# EAGLE board MPB-03a (EAGLE 6.0)
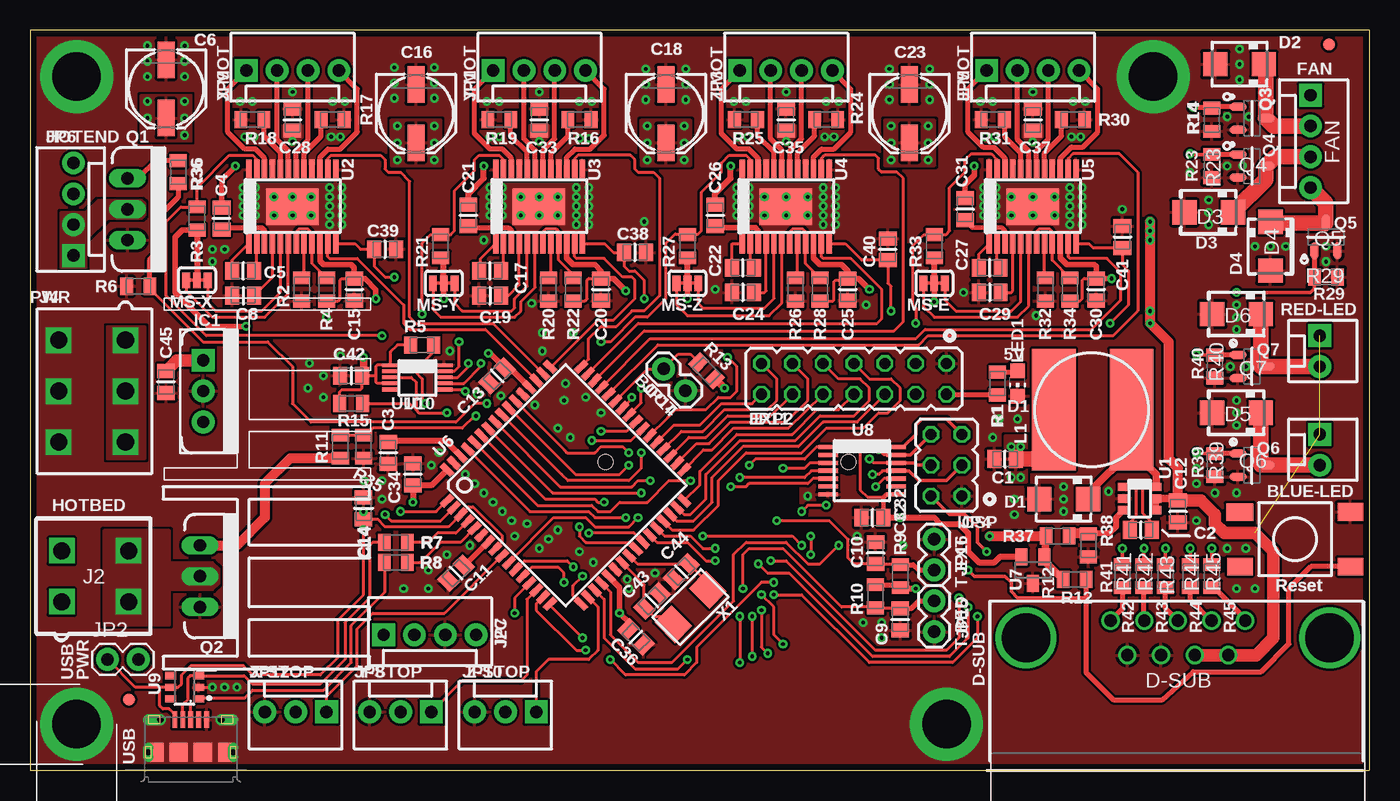
[diagram p1: board, top side]
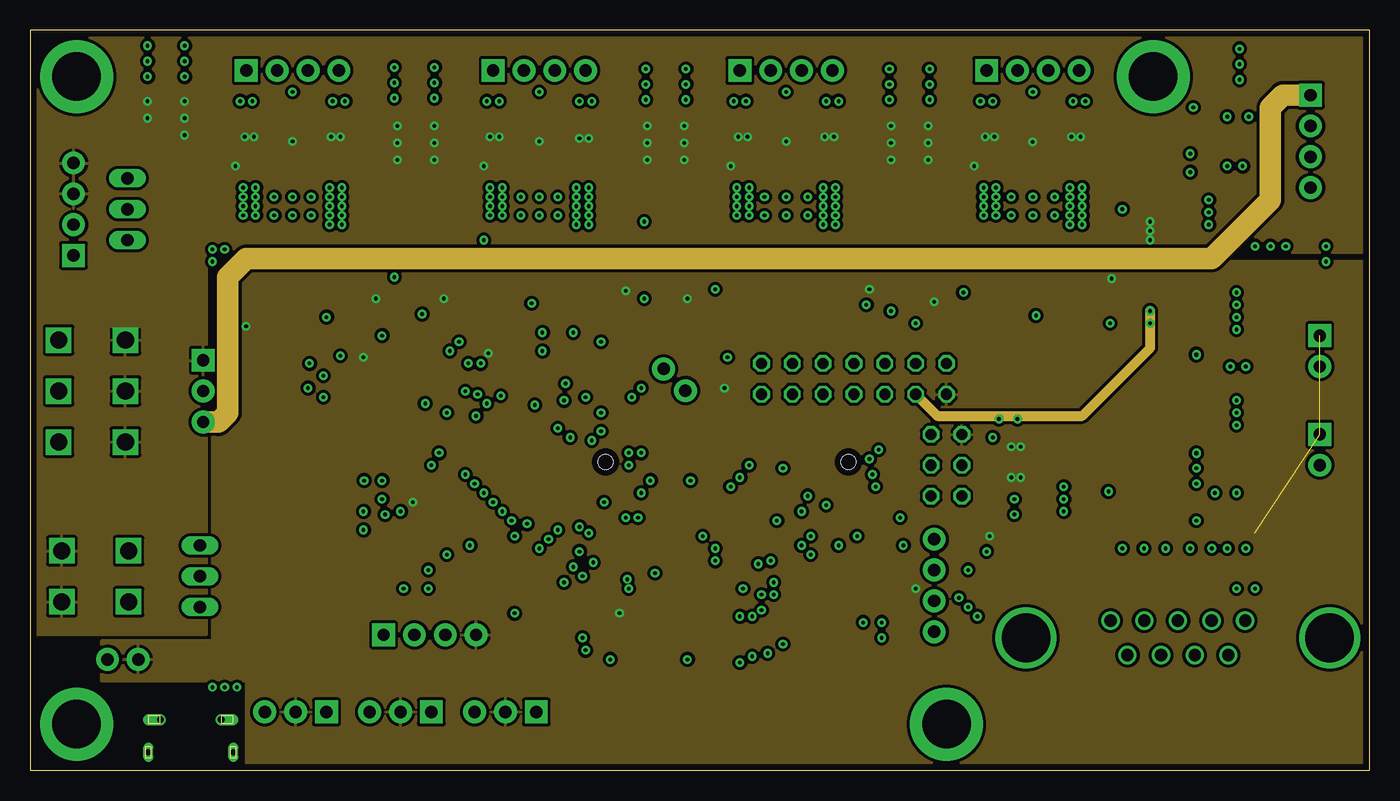
[diagram p2: board, inner layer PWR]
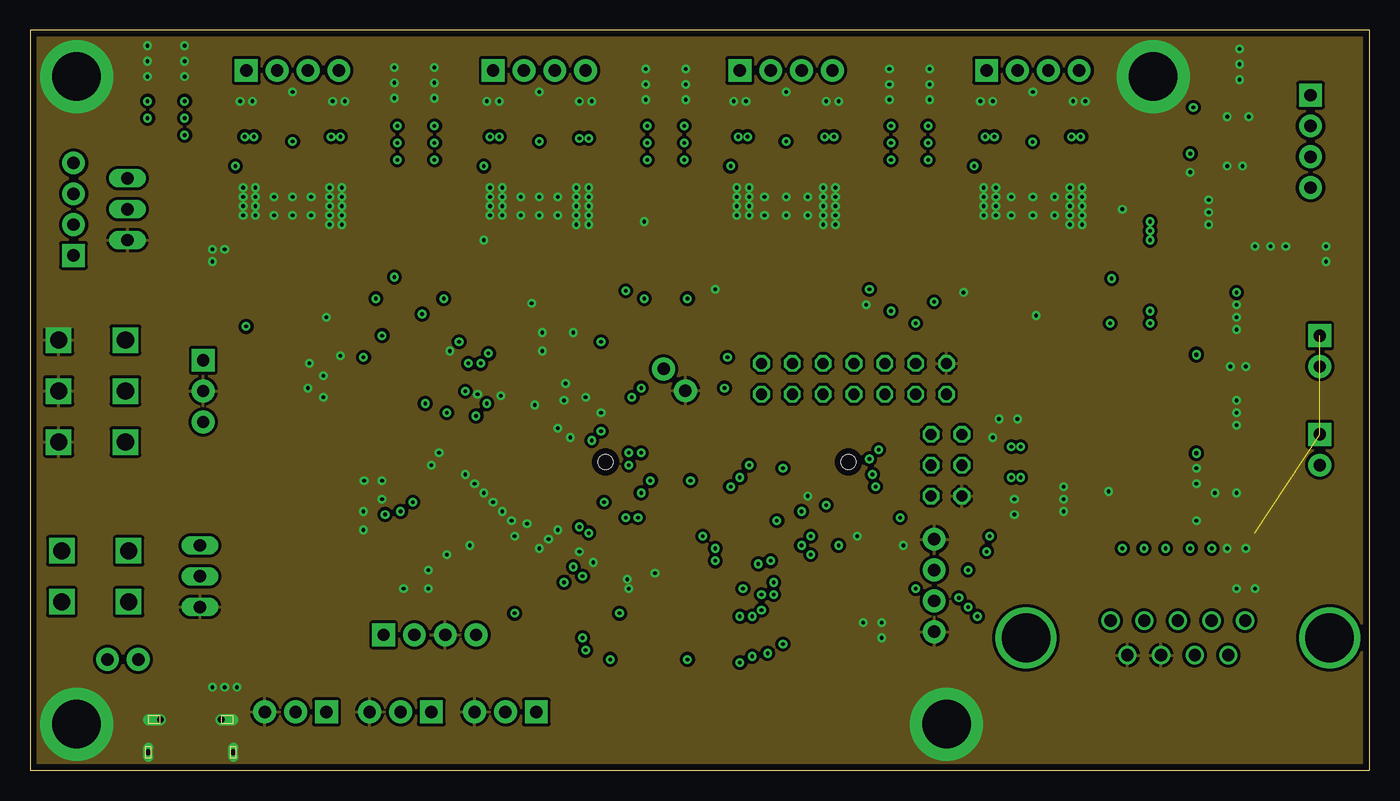
[diagram p3: board, inner layer GND]
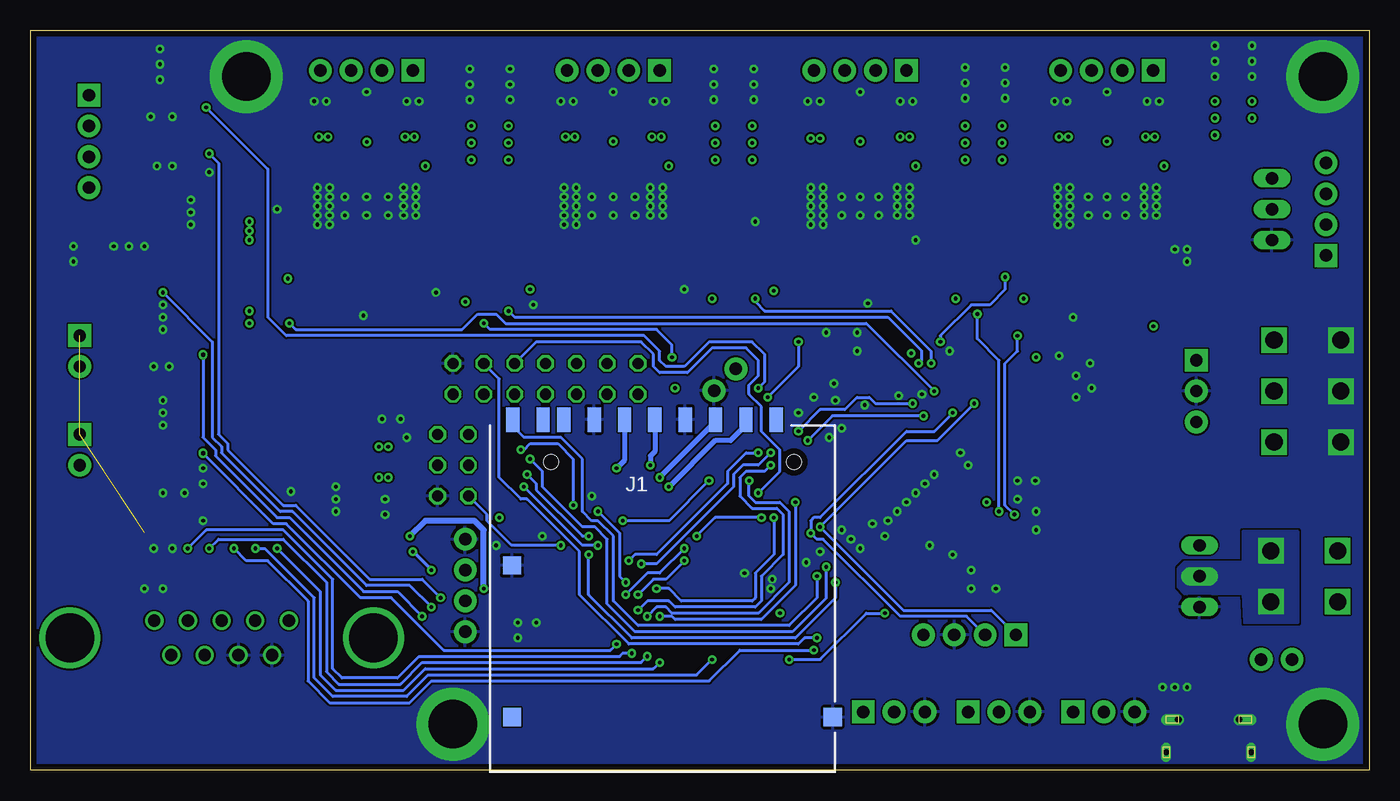
[diagram p4: board, bottom side, seen from below]

Size 110.24 x 60.96 mm. Coordinates in mm from the lower left corner, seen from the top.
Outline: 0,60.96 0,0 110.24,0 110.24,60.96 0,60.96
Copper layers (1*2+3*16): Top 0.035mm / dielectric 0.6mm / PWR 0.035mm / dielectric 0.2mm / GND 0.035mm / dielectric 0.6mm / Bottom 0.035mm
Design rules: minimum track width 6mil, minimum drill 12mil, track to track 6mil, track to pad 7mil, pad to pad 6mil, via to via 6mil, smd to smd 0mil, copper to edge 20mil, drill to drill 10mil, minimum pad ring 6mil, minimum via ring 8mil, stop-mask expansion 6mil, vias tented up to drill 100mil, thermal gap 10mil

## Footprints (pad centres in the part's own frame; a part is rotated, then mirrored left to right if it is on the bottom)
MOLEX-1X2 = drill 1.016 pad 1.88 square: 1 0,0 | drill 1.016 pad 1.88: 2 2.54,0
CAPC2012X145AN = smd 1.15 x 1.45: 1 -0.9,0; 2 0.9,0
PANASONIC_D = smd 3 x 1.4: + 2.4,0; - -2.4,0
SMA = smd 2 x 2: A 2,0; C -2,0
618009211721 = drill 1: 1 -5.54,1.42; 2 -2.77,1.42; 3 0,1.42; 4 2.77,1.42; 5 5.54,1.42; 6 -4.155,-1.42; 7 -1.385,-1.42; 8 1.385,-1.42; 9 4.155,-1.42 | drill 4: Z1 -12.5,0; Z2 12.5,0
MOLEX-1X4 = drill 1.016 pad 1.88 square: 1 0,0 | drill 1.016 pad 1.88: 2 2.54,0; 3 5.08,0; 4 7.62,0
TO220-15X17X25 = drill 1 pad 1.88: GND 0,0; OUT 2.54,0 | drill 1 pad 1.88 square: IN -2.54,0
SD-ATTEND = smd 1.1 x 2: 1 6.85,3.5; 2 4.35,3.5; 3 1.85,3.5; 4 -0.65,3.5; 5 -3.15,3.5; 6 -5.65,3.5; 7 -8.15,3.5; 8 -9.85,3.5; 9 9.35,3.5; SB -12.35,3.5 | smd 1.5 x 1.5: G 14,-21; SA -12.4,-21; SC -12.4,-8.5 | hole 1.2: -9.2,0; 10.8,0
5566-4 = drill 1.4 square: 1 2.1,-2.75; 2 -2.1,-2.75; 3 2.1,2.75; 4 -2.1,2.75
USB-MICROB-PTH = smd 0.4 x 1.35: D+ 0,1.905; D- -0.65,1.905; GND 1.3,1.905; ID 0.65,1.905; VBUS -1.3,1.905 | drill 0.5 pad 0.78 long: GND1 -3.5,-0.795; GND6 3.5,-0.795 | smd 1.225 x 1.55: GND2 -2.86,-0.795 | smd 1.5 x 1.55: GND3 -1,-0.795; GND4 1,-0.795 | smd 1.2 x 1.55: GND5 2.86,-0.795 | drill 0.55 pad 0.95 offset: GND7 2.5,1.905; GND8 -2.5,1.905
5566-6 = drill 1.4 square: 1 4.2,-2.75; 2 0,-2.75; 3 -4.2,-2.75; 4 4.2,2.75; 5 0,2.75; 6 -4.2,2.75
1X02 = drill 1.016 pad 1.88: 1 0,0; 2 2.54,0
JP3Q = drill 0.914 octagon: 1 -2.54,-1.27; 2 -2.54,1.27; 3 0,-1.27; 4 0,1.27; 5 2.54,-1.27; 6 2.54,1.27
MOLEX-1X3 = drill 1.016 pad 1.88 square: 1 0,0 | drill 1.016 pad 1.88: 2 2.54,0; 3 5.08,0
JP7Q = drill 0.914 octagon: 1 -7.62,-1.27; 2 -7.62,1.27; 3 -5.08,-1.27; 4 -5.08,1.27; 5 -2.54,-1.27; 6 -2.54,1.27; 7 0,-1.27; 8 0,1.27; 9 2.54,-1.27; 10 2.54,1.27; 11 5.08,-1.27; 12 5.08,1.27; 13 7.62,-1.27; 14 7.62,1.27
FIDUCIAL-1X2.5 = smd 1 x 1: 1 0,0
SDR1006 = smd 10.008 x 3.607: P$1 0,3.048; P$2 0,-3.353
CHIP-LED0805 = smd 1.2 x 1.2: A 0,-1.05; C 0,1.05
SJ_3_CONNECTED = smd 0.635 x 1.27: 1 -0.889,0; 2 0,0; 3 0.889,0
TO220V = drill 1.016 long: 1 -2.54,0; 2 0,0; 3 2.54,0
SOT95P280X135-3N = smd 1.4 x 0.65: 1 -1.15,0.95; 2 -1.15,-0.95; 3 1.15,0
RESC2012X70N = smd 1.05 x 1.4: 1 -0.95,0; 2 0.95,0
TACTILE_SWITCH_TALL = smd 2.1 x 1.45: A1 -4.55,-2.25; A2 4.55,-2.25; B2 4.55,2.25 | smd 2.25 x 1.45: B1 -4.55,2.225
TSOT6 = smd 0.69 x 1: 1 -1,-1.4; 2 -0.05,-1.4; 3 0.9,-1.4; 4 0.9,1.2; 5 -0.05,1.2; 6 -1,1.2
TSSOP-24 = smd 0.45 x 1.65: 1 -3.6,-3.1; 2 -2.95,-3.1; 3 -2.3,-3.1; 4 -1.65,-3.1; 5 -1,-3.1; 6 -0.35,-3.1; 7 0.3,-3.1; 8 0.95,-3.1; 9 1.6,-3.1; 10 2.25,-3.1; 11 2.9,-3.1; 12 3.55,-3.1; 13 3.55,3; 14 2.9,3; 15 2.25,3; 16 1.6,3; 17 0.95,3; 18 0.3,3; 19 -0.35,3; 20 -1,3; 21 -1.65,3; 22 -2.3,3; 23 -2.95,3; 24 -3.6,3 | smd 4.32 x 3: PAD -0.025,-0.05
TQFP64-2 = smd 1.194 x 0.508: 1 -7.8,6; 2 -7.8,5.2; 3 -7.8,4.4; 4 -7.8,3.6; 5 -7.8,2.8; 6 -7.8,2; 7 -7.8,1.2; 8 -7.8,0.4; 9 -7.8,-0.4; 10 -7.8,-1.2; 11 -7.8,-2; 12 -7.8,-2.8; 13 -7.8,-3.6; 14 -7.8,-4.4; 15 -7.8,-5.2; 16 -7.8,-6; 33 7.8,-6; 34 7.8,-5.2; 35 7.8,-4.4; 36 7.8,-3.6; 37 7.8,-2.8; 38 7.8,-2; 39 7.8,-1.2; 40 7.8,-0.4; 41 7.8,0.4; 42 7.8,1.2; 43 7.8,2; 44 7.8,2.8; 45 7.8,3.6; 46 7.8,4.4; 47 7.8,5.2; 48 7.8,6 | smd 0.508 x 1.194: 17 -6,-7.8; 18 -5.2,-7.8; 19 -4.4,-7.8; 20 -3.6,-7.8; 21 -2.8,-7.8; 22 -2,-7.8; 23 -1.2,-7.8; 24 -0.4,-7.8; 25 0.4,-7.8; 26 1.2,-7.8; 27 2,-7.8; 28 2.8,-7.8; 29 3.6,-7.8; 30 4.4,-7.8; 31 5.2,-7.8; 32 6,-7.8; 49 6,7.8; 50 5.2,7.8; 51 4.4,7.8; 52 3.6,7.8; 53 2.8,7.8; 54 2,7.8; 55 1.2,7.8; 56 0.4,7.8; 57 -0.4,7.8; 58 -1.2,7.8; 59 -2,7.8; 60 -2.8,7.8; 61 -3.6,7.8; 62 -4.4,7.8; 63 -5.2,7.8; 64 -6,7.8
SOT23C = smd 1 x 1.4: 1 -0.95,-1.1; 2 0.95,-1.1; 3 0,1.1
TSSOP14 = smd 0.35 x 1.6: 1 -2,-2.9; 2 -1.35,-2.9; 3 -0.7,-2.9; 4 -0.05,-2.9; 5 0.6,-2.9; 6 1.25,-2.9; 7 1.9,-2.9; 8 1.9,2.7; 9 1.25,2.7; 10 0.6,2.7; 11 -0.05,2.7; 12 -0.7,2.7; 13 -1.35,2.7; 14 -2,2.7
SOT23-6 = smd 0.6 x 0.9: 1 -0.95,-1.15; 2 0,-1.15; 3 0.95,-1.15; 4 0.95,1.15; 5 0,1.15; 6 -0.95,1.15
MSOP10 = smd 0.3 x 1.4: 1 -1,-2.2; 2 -0.5,-2.2; 3 0,-2.2; 4 0.5,-2.2; 5 1,-2.2; 6 1,2.2; 7 0.5,2.2; 8 0,2.2; 9 -0.5,2.2; 10 -1,2.2
NDK-XTAL = smd 2 x 2.4: P$1 -2,0; P$2 2,0

## Placement (x,y rotation side)
BLUE-LED  [MOLEX-1X2]  106.17,27.69 270 top
C1  22uF  [CAPC2012X145AN]  80.26,25.65 180 top
C2  0.22uF  [CAPC2012X145AN]  91.44,19.81 180 top
C3  0.1uF  [CAPC2012X145AN]  29.46,26.16 270 top
C4  0.1uF  [CAPC2012X145AN]  15.75,45.47 270 top
C5  0.1uF  [CAPC2012X145AN]  17.53,41.15 180 top
C6  100uF  [PANASONIC_D]  11.18,56.13 270 top
C8  0.22uF  [CAPC2012X145AN]  17.53,39.12 0 top
C9  10uF  [CAPC2012X145AN]  71.63,12.45 90 top
C10  10uF  [CAPC2012X145AN]  69.6,17.91 270 top
C11  1uF  [CAPC2012X145AN]  35.05,16.26 45 top
C12  1uF  [CAPC2012X145AN]  94.49,21.34 270 top
C13  0.1uF  [CAPC2012X145AN]  38.43,32.51 45 top
C14  0.1uF  [CAPC2012X145AN]  27.43,21.59 90 top
C15  10uF  [CAPC2012X145AN]  26.67,39.62 90 top
C16  100uF  [PANASONIC_D]  31.75,54.1 270 top
C17  0.1uF  [CAPC2012X145AN]  37.85,41.15 180 top
C18  100uF  [PANASONIC_D]  52.32,54.1 270 top
C19  0.22uF  [CAPC2012X145AN]  37.85,39.12 0 top
C20  10uF  [CAPC2012X145AN]  46.99,39.62 90 top
C21  0.1uF  [CAPC2012X145AN]  36.07,45.72 270 top
C22  0.1uF  [CAPC2012X145AN]  58.67,41.4 180 top
C23  100uF  [PANASONIC_D]  72.39,54.1 270 top
C24  0.22uF  [CAPC2012X145AN]  58.67,39.37 0 top
C25  10uF  [CAPC2012X145AN]  67.31,39.62 90 top
C26  0.1uF  [CAPC2012X145AN]  56.39,45.72 270 top
C27  0.1uF  [CAPC2012X145AN]  78.99,41.4 180 top
C28  0.1uF  [CAPC2012X145AN]  21.59,53.59 90 top
C29  0.22uF  [CAPC2012X145AN]  78.99,39.37 0 top
C30  10uF  [CAPC2012X145AN]  87.76,39.62 90 top
C31  0.1uF  [CAPC2012X145AN]  76.96,46.23 270 top
C32  10uF  [CAPC2012X145AN]  69.34,20.83 180 top
C33  0.1uF  [CAPC2012X145AN]  41.91,53.59 90 top
C34  0.1uF  [CAPC2012X145AN]  31.5,24.38 270 top
C35  0.1uF  [CAPC2012X145AN]  62.23,53.59 90 top
C36  0.1uF  [CAPC2012X145AN]  49.86,11 135 top
C37  0.1uF  [CAPC2012X145AN]  82.55,53.59 90 top
C38  0.1uF  [CAPC2012X145AN]  49.78,42.67 0 top
C39  0.1uF  [CAPC2012X145AN]  29.21,42.93 0 top
C40  0.1uF  [CAPC2012X145AN]  70.61,42.93 90 top
C41  0.1uF  [CAPC2012X145AN]  89.92,43.94 90 top
C42  0.1uF  [CAPC2012X145AN]  26.42,32.51 0 top
C43  10pF  [CAPC2012X145AN]  51.18,13.97 225 top
C44  10pF  [CAPC2012X145AN]  53.59,16.38 45 top
C45  0.1uF  [CAPC2012X145AN]  11.18,32 270 top
D1  [SMA]  85.09,22.35 180 top
D2  [SMA]  99.57,58.17 180 top
D3  [SMA]  97.03,45.97 180 top
D4  [SMA]  102.11,43.18 270 top
D5  [SMA]  99.31,29.46 180 top
D6  [SMA]  99.31,37.59 180 top
D-SUB  618009211721  [618009211721]  94.49,10.92 0 top
FAN  MOT-Y  [MOLEX-1X4]  105.41,55.63 270 top
IC1  [TO220-15X17X25]  14.22,31.24 270 top
J1  SD-ATTEND  [SD-ATTEND]  58.17,25.4 0 bottom
J2  5566-4  [5566-4]  5.33,16 270 top
J3  USB-MICRO-PTH  [USB-MICROB-PTH]  13.21,2.29 0 top
J4  PCIE  [5566-6]  5.08,31.24 90 top
JP1  MOT-Y  [MOLEX-1X4]  38.1,57.66 0 top
JP2  USBPWR  [1X02]  6.35,9.14 0 top
JP3  MOT-Z  [MOLEX-1X4]  58.42,57.66 0 top
JP4  ICSP  [JP3Q]  75.44,25.15 90 top
JP5  MOT-E  [MOLEX-1X4]  78.74,57.66 0 top
JP6  HOTEND  [MOLEX-1X4]  3.56,42.42 90 top
JP7  I2C  [MOLEX-1X4]  29.08,11.18 0 top
JP8  Y-STOP  [MOLEX-1X3]  33.02,4.83 180 top
JP9  MOT-X  [MOLEX-1X4]  17.78,57.66 0 top
JP10  Z-STOP  [MOLEX-1X3]  41.66,4.83 180 top
JP11  EXP2  [JP7Q]  67.82,32.26 180 top
JP12  X-STOP  [MOLEX-1X3]  24.38,4.83 180 top
JP14  BOOT  [1X02]  53.94,31.28 135 top
JP15  B-THERM  [1X02]  74.42,13.97 270 top
JP16  E-THERM  [1X02]  74.42,16.51 90 top
JP26  FIDUCIAL1X2.5  [FIDUCIAL-1X2.5]  8.13,5.84 0 top
JP33  FIDUCIAL1X2.5  [FIDUCIAL-1X2.5]  106.93,59.82 0 top
L1  47uH  [SDR1006]  87.63,29.72 270 top
LED1  PWR  [CHIP-LED0805]  81.28,31.88 180 top
MS-E  [SJ_3_CONNECTED]  74.42,40.13 180 top
MS-X  [SJ_3_CONNECTED]  13.72,40.39 180 top
MS-Y  [SJ_3_CONNECTED]  34.04,40.13 180 top
MS-Z  [SJ_3_CONNECTED]  54.1,40.13 180 top
Q1  RFP30N06LE  [TO220V]  8,46.23 270 top
Q2  RFP30N06LE  [TO220V]  13.97,16 270 top
Q3  RFP30N06LE  [SOT95P280X135-3N]  100.58,53.72 0 top
Q4  RFP30N06LE  [SOT95P280X135-3N]  100.58,49.78 0 top
Q5  RFP30N06LE  [SOT95P280X135-3N]  106.68,43.94 90 top
Q6  RFP30N06LE  [SOT95P280X135-3N]  100.58,25.15 0 top
Q7  RFP30N06LE  [SOT95P280X135-3N]  100.58,33.27 0 top
R1  330  [RESC2012X70N]  79.63,31.88 270 top
R2  10k  [RESC2012X70N]  22.35,39.62 270 top
R3  100k  [RESC2012X70N]  13.72,45.47 90 top
R4  100k  [RESC2012X70N]  24.38,39.62 90 top
R5  4.7k  [RESC2012X70N]  32.26,35.05 180 top
R6  100k  [RESC2012X70N]  8.89,39.88 180 top
R7  22  [RESC2012X70N]  30.1,18.8 0 top
R8  22  [RESC2012X70N]  30.1,17.14 0 top
R9  4.7k  [RESC2012X70N]  71.63,16 270 top
R10  4.7k  [RESC2012X70N]  69.6,14.35 90 top
R11  100  [RESC2012X70N]  25.53,26.67 270 top
R12  100k  [RESC2012X70N]  85.98,15.75 180 top
R13  100k  [RESC2012X70N]  55.67,32.91 315 top
R14  100k  [RESC2012X70N]  97.28,53.59 270 top
R15  4.7k  [RESC2012X70N]  26.42,30.23 180 top
R16  0.11  [RESC2012X70N]  45.21,53.59 0 top
R17  0.11  [RESC2012X70N]  24.89,53.59 0 top
R18  0.11  [RESC2012X70N]  18.29,53.59 180 top
R19  0.11  [RESC2012X70N]  38.61,53.59 180 top
R20  10k  [RESC2012X70N]  42.67,39.62 270 top
R21  100k  [RESC2012X70N]  33.78,43.18 90 top
R22  100k  [RESC2012X70N]  44.7,39.62 90 top
R23  100k  [RESC2012X70N]  97.28,49.78 270 top
R24  0.11  [RESC2012X70N]  65.53,53.59 0 top
R25  0.11  [RESC2012X70N]  58.93,53.59 180 top
R26  10k  [RESC2012X70N]  62.99,39.62 270 top
R27  100k  [RESC2012X70N]  54.1,43.18 90 top
R28  100k  [RESC2012X70N]  65.02,39.62 90 top
R29  100k  [RESC2012X70N]  106.68,40.64 0 top
R30  0.11  [RESC2012X70N]  85.85,53.59 0 top
R31  0.11  [RESC2012X70N]  79.25,53.59 180 top
R32  10k  [RESC2012X70N]  83.57,39.62 270 top
R33  100k  [RESC2012X70N]  74.42,43.18 90 top
R34  100k  [RESC2012X70N]  85.6,39.62 90 top
R35  100k  [RESC2012X70N]  27.43,26.67 270 top
R36  100  [RESC2012X70N]  12.19,49.28 90 top
R37  5.6k  [RESC2012X70N]  84.58,19.3 0 top
R38  1k  [RESC2012X70N]  87.12,18.54 270 top
R39  100k  [RESC2012X70N]  97.54,25.15 270 top
R40  100k  [RESC2012X70N]  97.54,33.27 270 top
R41  100  [RESC2012X70N]  89.92,16 270 top
R42  100  [RESC2012X70N]  91.69,16 270 top
R43  100  [RESC2012X70N]  93.47,16 270 top
R44  100  [RESC2012X70N]  95.5,16 270 top
R45  100  [RESC2012X70N]  97.28,16 270 top
RED-LED  [MOLEX-1X2]  106.17,35.81 270 top
S1  Reset  [TACTILE_SWITCH_TALL]  104.14,19.05 0 top
U1  LM2841  [TSOT6]  91.44,22.35 270 top
U2  A4982  [TSSOP-24]  21.59,46.48 0 top
U3  A4982  [TSSOP-24]  41.91,46.48 0 top
U4  A4982  [TSSOP-24]  62.23,46.48 0 top
U5  A4982  [TSSOP-24]  82.55,46.48 0 top
U6  AT90USB1286  [TQFP64-2]  44.07,23.5 45 top
U7  AP7313  [SOT23C]  82.55,16.51 180 top
U8  TXB0104  [TSSOP14]  68.58,24.64 270 top
U9  PRTR5V0U4D  [SOT23-6]  12.7,6.86 90 top
U10  MCP4728  [MSOP10]  31.88,32.38 270 top
X1  16MHz  [NDK-XTAL]  54.36,13.46 225 top

## Tracks (layer width: path | path; a pad name or v marks a point on that pad's centre or on a via)
!E-ENABLE  (via drill 0.3)
  Top 0.254: v57.4,34.04 58.17,33.27 58.17,31.24 57.66,30.73 56.64,30.73 55.63,29.72 53.12,29.72 52.48,29.08 | U5.23 79.6,50.32 79.12,50.8 77.47,50.8 76.96,50.29 76.96,49.28 75.69,48.01 75.69,44.45 75.37,44.13 R33.2 73.59,44.13 72.64,43.18 72.64,38.35 72.9,38.1 v72.9,36.83 | U6.38 52.48,29.08 | 52.48,29.08
  Bottom 0.254: v57.4,34.04 57.4,35.05 58.67,36.32 72.39,36.32 v72.9,36.83
!HOTBED  (via drill 0.3)
  Top 0.254: v46.23,27.18 49.45,27.18 U6.39 | R11.1 R35.1 27.69,27.69 28.19,28.19 35.56,28.19 36.57,29.2 v36.69,29.2
  Bottom 0.254: v36.69,29.2 44.2,29.2 v46.23,27.18
!HOTEND  (via drill 0.3)
  Top 0.254: v37.59,30.23 36.58,30.23 35.05,28.7 23.11,28.7 21.59,30.23 21.59,33.27 19.56,35.31 14.22,35.31 9.84,39.69 R6.1 | U6.40 49.08,27.94 v46.99,27.94
  Top 0.406: R6.1 9.84,42.1 10.41,42.67 10.41,45.47 12.19,47.24 R36.1
  Bottom 0.254: v37.59,30.23 40.64,30.23 41.15,30.73 42.16,30.73 43.18,29.72 45.21,29.72 v46.99,27.94
!RESET  (via drill 0.3)
  Top 0.254: U6.20 47.75,14.72 47.75,11.18 50.04,8.89 52.83,8.89 57.91,13.97 57.91,17.78 58.93,18.8 62.23,18.8 64.01,17.02 65.02,17.02 v66.55,18.54
  Top 0.305: JP4.2 75.69,21.08 76.96,21.08 77.98,20.07 77.98,18.8 v78.74,18.03 | v77.22,16.51 77.72,16 80.26,16 80.77,15.49 80.77,14.73 81.28,14.22 86.87,14.22 86.87,15.69 R12.1
  Top 0.406: S1.A2 105.45,16.8 103.63,14.99 103.63,10.41 101.35,8.13 95.76,8.13 93.22,5.84 89.15,5.84 86.93,8.07 R12.1
  Bottom 0.254: v66.55,18.54 70.61,18.54 72.64,20.57 72.64,21.08 JP4.2
  Bottom 0.305: v77.22,16.51 v78.74,18.03
!X-ENABLE  (via drill 0.3)
  Top 0.254: U2.23 18.64,50.32 18.29,50.67 16.38,50.67 13.72,48.01 R3.2 12.38,46.42 11.18,45.21 11.18,39.12 14.48,35.81 v28.96,35.81 | v29.21,21.08 29.72,20.57 33.79,20.57 U6.2
  Bottom 0.254: v29.21,21.08 29.97,21.84 29.97,33.53 28.96,34.54 v28.96,35.81
!Y-ENABLE  (via drill 0.3)
  Top 0.254: U3.23 38.96,50.32 38.61,50.67 36.96,50.67 36.58,50.29 36.58,49.4 34.92,47.75 34.92,44.45 34.6,44.13 R21.2 32.95,44.13 32.26,43.43 v32.26,37.59 | v30.48,21.34 33.42,21.34 U6.1
  Bottom 0.254: v30.48,21.34 30.48,33.78 32.26,35.56 v32.26,37.59
!Z-ENABLE  (via drill 0.3)
  Top 0.254: U4.23 59.28,50.32 58.93,50.67 57.53,50.67 56.9,50.04 56.9,49.28 55.24,47.62 55.24,44.45 54.99,44.2 54.04,44.2 | 54.04,44.2 53.09,44.2 52.32,43.43 52.32,38.86 50.8,37.34 49.78,37.34 47.75,35.31 v46.99,35.31 | 54.04,44.2 R27.2 | U6.42 49.53,30.65 v49.53,30.73
  Bottom 0.254: v46.99,35.31 46.99,33.27 v49.53,30.73
+3V3  (via drill 0.3)
  Top 0.254: U8.8 | 70.24,22.49 68.95,22.49 68.33,23.11 68.33,26.16 67.85,26.64 U8.1 64.74,26.64 63.75,25.65 59.69,25.65 v59.18,25.15
  Top 0.356: U8.8 70.49,22.74 70.24,22.49 C32.1
  Top 0.508: C32.1 v71.63,20.83 74.42,20.83 74.93,20.32 76.45,20.32 77.22,19.56 77.22,18.03 78.15,17.1 79.33,17.1 79.76,17.53 79.84,17.61 U7.2
  Bottom 0.406: J1.4 58.82,26.27 59.18,25.91 v59.18,25.15
+5V  (via drill 0.3)
  Top 0.254: R4.1 25.34,38.67 25.53,38.86 25.53,40.39 25.65,40.51 26.66,40.51 C15.2 | R22.1 45.66,38.67 45.85,38.86 45.85,40.39 45.98,40.52 C20.2 | C25.2 67.17,40.39 66.29,40.39 66.17,40.26 66.17,38.73 66.11,38.67 R28.1 | R34.1 86.43,38.67 86.61,38.86 86.61,40.39 86.75,40.52 C30.2 | 49.33,12.14 49.33,11.99 49.28,11.94 | U10.4 28.57,31.89 28.45,32 28.45,32.51 | 28.45,32.51 28.45,33.27 28.56,33.38 U10.1 29.68,34.5 30.23,35.05 R5.2 | 28.45,32.51 C42.2 27.3,32.5 27.3,31.5 27.18,31.37 25.65,31.37 25.47,31.18 R15.2
  Top 0.305: U8.14 71.85,26.64 72.9,27.69 72.9,28.45 73.41,28.96 75.44,28.96 JP4.5
  Top 0.406: 49.28,11.94 49.22,11.94 C36.2 | R10.2 71.31,15.3 71.63,14.99 R9.2 | R1.2 75.44,30.93 JP11.2
  Top 0.457: U2.10 23.84,41.95 24.13,41.66 26.42,41.66 26.67,41.4 C15.2 27.55,40.52 28.45,39.62 v28.45,38.86 | R3.1 12.51,44.52 11.94,43.94 11.94,39.37 14.73,36.58 v17.76,36.58 | U3.10 44.16,42.2 44.7,41.66 46.48,41.66 46.99,41.15 C20.2 48.01,40.52 v49.02,39.51 | MS-Y.2 v34.04,38.86 | U4.10 64.48,42.2 65.02,41.66 66.8,41.66 67.31,41.15 C25.2 68.19,40.52 v69.09,39.62 | MS-Z.2 v54.1,38.86 | U5.10 84.8,42.2 85.34,41.66 87.63,41.66 87.76,41.53 C30.2 89.02,40.52 v89.03,40.51 | MS-E.2 v74.42,38.61 | U6.21 48.51,15.09 v48.51,12.95 49.33,12.14
  Top 0.508: R3.1 MS-X.2 | MS-Y.2 34.04,41.98 R21.1 | MS-Z.2 R27.1 | MS-E.2 R33.1 | R9.2 71.69,14.99 v72.9,14.99 | U6.64 33.03,23.48 C34.2 v31.5,22.1 | U6.52 39.51,33.15 C13.2 | v37.72,34.35 37.86,34.35 C13.2 | C13.2 38.99,33.15
  Top 0.61: v27.43,34.04 27.43,32.63 C42.2 | v57.15,31.5 56.41,32.24 R13.2 | 83.57,19.3 83.57,17.61 U7.1 83.5,17.28 R12.2
  Top 0.813: v78.99,19.3 83.57,19.3 R37.1
  Top 1.27: C1.1 83.82,25.65 84.33,26.16 84.33,29.67 L1.P$2
  Bottom 0.508: v72.9,14.99 72.9,19.81 73.66,20.57 77.72,20.57 v78.99,19.3
  other vias: 80.77,26.67 81.53,26.67 80.77,24.13 81.53,24.13
  pour PWR (isolate 0.254): 110.24,41.91 14.99,41.91 14.99,10.67 5.84,10.67 5.84,7.37 17.78,7.37 17.78,0 110.24,0
  pour Top (isolate 0.254): 82.04,23.75 82.04,27.56 80.26,27.56 80.26,23.75
+12V
  PWR 1.778: IC1.OUT 15.49,28.7 16.26,29.46 16.26,40.64 17.78,42.16 97.28,42.16 102.11,46.99 102.11,54.61 103.12,55.63 FAN.1
+24V  (via drill 0.3)  (2 unrouted)
  Top 0.254: 94.49,22.1 94.49,22.23 C12.1
  Top 0.406: v16.89,49.78 15.75,48.64 15.75,48.01
  Top 0.457: C4.1 15.75,48.01 | C31.1 76.96,48.26 77.72,49.02 v77.72,49.78
  Top 0.508: C31.1 76.57,47.13 | 36.44,46.62 C21.1 36.07,47.5 37.34,48.77 v37.34,49.78 | v57.66,49.78 57.66,48.77 56.39,47.5 C26.1
  Top 0.61: U1.4 U1.5 94.31,22.4 94.49,22.23
  Top 0.813: C12.1 94.49,24.89 93.73,25.65 93.73,35.31 v92.2,36.83 v92.2,37.85 v92.2,43.69 v92.2,44.45 v92.2,45.21
  Top 1.016: D-SUB.9 D-SUB.8 100.94,9.5 102.36,10.92 102.36,18.03 100.84,19.56 98.3,19.56 97.54,20.32 97.54,21.08 96.38,22.24 C12.1 | IC1.IN 12.05,33.78 C45.1
  PWR 0.813: JP11.4 74.68,29.21 86.61,29.21 92.2,34.8 v92.2,37.85
  other vias: 17.65,52.2 25.53,52.2 37.85,52.2 45.97,52.07 66.17,52.2 82.52,51.77 86.49,52.2 62.23,51.82 41.91,51.82 21.59,51.82 58.29,52.2 78.61,52.2 73.91,53.09 73.91,51.69 73.91,50.29 70.87,53.09 70.87,51.69 70.87,50.29 12.7,55.12 12.7,53.72 12.7,52.32 9.65,55.12 9.65,53.72 53.85,53.09 53.85,51.69 53.85,50.29 50.8,53.09 50.8,51.69 50.8,50.29 33.27,53.09 33.27,51.69 33.27,50.29 30.23,53.09 30.23,51.69 30.23,50.29 45.21,52.07 38.61,52.2 18.41,52.2 24.77,52.2 59.05,52.2 65.41,52.2 79.38,52.2 85.72,52.2
  pour PWR (isolate 0.254, rank 6): 110.24,42.67 14.48,42.42 14.48,11.18 0,11.18 0,60.96 110.24,60.96
  pour Top (no thermals): 78.74,50.04 86.61,50.04 86.61,51.31 87.88,52.58 87.88,53.09 77.47,53.09 77.47,52.32 78.74,51.05
  pour Top (isolate 0.254): 70.61,53.59 74.42,53.59 74.42,49.78 70.36,49.78 70.36,53.59
  pour Top (no thermals): 58.29,50.04 66.17,50.04 66.17,51.31 67.44,52.58 67.44,53.09 57.02,53.09 57.02,52.32 58.29,51.05
  pour Top (no thermals): 37.97,50.04 45.85,50.04 45.85,51.31 47.12,52.58 47.12,53.09 36.7,53.09 36.7,52.32 37.97,51.05
  pour Top (no thermals): 17.65,50.04 25.53,50.04 25.53,51.31 26.8,52.58 26.8,53.09 16.38,53.09 16.38,52.32 17.65,51.05
  pour Top: 9.14,55.63 13.21,55.63 13.21,51.82 9.14,51.82
  pour Top (isolate 0.254): 50.55,53.59 54.36,53.59 54.36,49.78 50.29,49.78 50.29,53.59
  pour Top (isolate 0.254): 29.97,53.59 33.78,53.59 33.78,49.78 29.72,49.78 29.72,53.59
  pour PWR (isolate 0.254, no thermals): 9.65,48.01 6.6,48.01 6.6,36.58 9.65,36.58
  pour Top (isolate 0.254, no thermals): 6.35,36.58 9.4,36.58 9.4,25.65 6.35,25.65
ALE
  Top 0.254: U6.43 50.82,33.08 JP14.2 52.14,33.09 53.34,34.29 54.36,34.29 55.12,33.53 55.05,33.53 R13.1
AREF
  Top 0.508: C3.1 29.58,27.18 34.16,27.18 U6.62
B-THERM  (via drill 0.3)
  Top 0.254: C9.2 71.57,13.4 R10.1 69.53,13.46 66.8,13.46 61.98,18.29 59.18,18.29 58.67,17.78 v58.67,14.99 | U6.61 41.14,21.34 45.97,21.34 46.48,20.83 v49.02,20.83
  Top 0.406: C9.2 72.53,13.35 73.15,13.97 JP15.1
  Bottom 0.254: v49.02,20.83 49.02,17.78 50.55,16.26 50.55,14.22 50.8,13.97 56.64,13.97 57.66,14.99 v58.67,14.99
BLUE-LED  (via drill 0.3)
  Top 0.254: U6.27 51.6,18.8 54.1,18.8 55.63,17.27 v56.39,17.27 | v61.98,10.41 61.21,11.18 61.21,13.46 v60.2,14.48
  Top 0.305: R39.1 v96.01,26.1 v96.01,26.16
  Top 0.406: Q6.1 R39.1
  Bottom 0.254: v61.98,10.41 62.48,9.91 76.2,9.91 80.52,14.22 83.06,14.22 89.15,20.32 90.24,20.32 v96.01,26.1 | v56.39,17.27 57.91,15.75 58.93,15.75 v60.2,14.48
CONTROLLER_FAN  (via drill 0.3)
  Top 0.254: v50.29,26.16 50.29,24.89 49.28,23.88 44.25,23.88 43.75,24.38 | 43.75,24.38 | U6.56 43.75,24.38 | v76.45,14.22 76.45,10.92 75.44,9.91 69.6,9.91 62.23,17.27 v60.96,17.27
  Top 0.305: R23.1 95.57,50.73 v95.5,50.8
  Top 0.406: Q4.1 R23.1
  Bottom 0.254: v50.29,26.16 51.31,26.16 52.83,24.64 52.83,23.62 58.67,17.78 60.45,17.78 v60.96,17.27 | v95.5,50.8 94.74,50.04 94.74,27.69 93.98,26.92 93.98,26.42 89.41,21.84 88.39,21.84 82.3,15.75 77.98,15.75 v76.45,14.22
E-DIR
  Top 0.254: U5.14 85.45,50.4 85.85,50.8 89.66,50.8 91.19,49.28 91.19,37.85 89.15,35.81 73.91,35.81 73.15,35.05 51.67,35.05 U6.44
E-STEP
  Top 0.254: U5.11 85.45,42.31 85.6,42.16 88.65,42.16 89.79,41.02 89.79,38.73 87.38,36.32 73.66,36.32 72.9,35.56 51.04,35.56 U6.45
E-THERM  (via drill 0.3)
  Top 0.254: 69.58,17.02 C10.2 | C10.2 71.57,17.01 R9.1 | C10.2 67.83,17.01 67.31,17.53 67.32,18.55 67.32,19.04 65.79,20.57 v61.47,20.57 | U6.60 41.76,21.84 46.23,21.84 46.74,21.34 47.75,21.34 48.51,22.1 50.8,22.1 52.58,23.88 v54.36,23.88
  Top 0.406: R9.1 72.71,16.95 73.15,16.51 JP16.1
  Bottom 0.254: v54.36,23.88 57.66,20.57 v61.47,20.57
EX-DIR  (via drill 0.3)
  Top 0.254: U6.19 47.24,14.1 47.24,10.92 49.78,8.38 53.34,8.38 v54.1,9.14
  Top 0.305: R42.1 v91.69,18.29
  Bottom 0.254: v54.1,9.14 55.37,7.87 77.47,7.87 79.25,6.1 85.34,6.1 86.87,7.62 86.87,14.22 90.93,18.29 v91.69,18.29
EX-ENABLE  (via drill 0.3)
  Top 0.254: U6.57 43.63,23.37 49.53,23.37 50.04,23.88 v51.05,23.88 | v59.44,12.7 v59.44,9.4
  Top 0.305: R44.1 v95.5,18.29
  Bottom 0.254: v51.05,23.88 51.05,22.61 50.55,22.1 48.51,22.1 47.75,21.34 47.75,15.49 50.29,12.95 57.4,12.95 57.91,13.46 58.67,13.46 v59.44,12.7 | v59.44,9.4 59.94,8.89 77.98,8.89 79.76,7.11 84.84,7.11 85.85,8.13 85.85,15.49 89.41,19.05 94.74,19.05 v95.5,18.29
EX-HOTEND  (via drill 0.3)
  Top 0.254: U6.55 44.88,24.38 48.51,24.38 v49.28,25.15 | v60.2,13.21 60.2,10.16 v60.71,9.65
  Top 0.305: R45.1 v97.28,18.29
  Bottom 0.254: v49.28,25.15 49.78,24.64 51.31,24.64 51.82,24.13 51.82,22.61 50.8,21.59 48.77,21.59 48.26,21.08 48.26,17.78 50.04,16 50.04,13.97 50.55,13.46 57.15,13.46 57.66,13.97 59.44,13.97 v60.2,13.21 | v60.71,9.65 61.47,9.65 61.72,9.4 78.23,9.4 80.01,7.62 84.58,7.62 85.34,8.38 85.34,15.75 89.41,19.81 95.76,19.81 v97.28,18.29
EX-STEP  (via drill 0.3)
  Top 0.254: U6.15 41.66,13.73 41.66,13.21 44.96,9.91 v45.72,9.91
  Top 0.305: R43.1 v93.47,18.29
  Bottom 0.254: v45.72,9.91 51.82,9.91 54.36,7.37 77.22,7.37 78.99,5.59 85.6,5.59 87.38,7.37 87.38,13.97 90.68,17.27 92.46,17.27 v93.47,18.29
EX-TERM  (via drill 0.3)
  Top 0.254: U6.59 42.38,22.35 46.48,22.35 46.74,22.1 v47.24,22.1 | v58.42,12.7 v58.42,8.89
  Top 0.305: R41.1 v89.92,18.29
  Bottom 0.254: v89.92,18.29 86.36,14.73 86.36,7.87 85.09,6.6 79.5,6.6 77.72,8.38 58.93,8.38 v58.42,8.89 | v47.24,22.1 47.24,15.24 50.04,12.45 57.15,12.45 57.4,12.7 v58.42,12.7
EXTRUDER_0_FAN  (via drill 0.3)
  Top 0.254: U6.54 43.98,26.42 43.98,26.38 44.2,26.16 46.48,26.16 46.99,26.67 48.77,26.67 v49.28,26.16 | v77.22,13.46 77.22,10.92 75.69,9.4 69.34,9.4 62.48,16.26 60.71,16.26 v59.94,17.02
  Top 0.305: R29.1 105.73,39.69 105.41,39.37 v99.31,39.37
  Top 0.406: Q5.1 R29.1
  Bottom 0.254: v49.28,26.16 50.29,25.15 51.56,25.15 52.32,24.38 52.32,23.37 58.67,17.02 v59.94,17.02 | v99.31,39.37 95.25,35.31 95.25,27.43 94.49,26.67 94.49,26.16 89.66,21.34 88.65,21.34 82.55,15.24 78.99,15.24 v77.22,13.46
GND  (via drill 0.3, 4 pad 6)
  Top 0.254: U9.2 v14.99,6.86
  other vias: 36.2,18.54 25.53,34.16 27.48,23.88 75.44,3.81 3.81,3.81 3.81,57.15 92.46,57.15 17.27,55.12 25.91,55.12 20.07,47.24 21.59,47.24 23.11,47.24 20.07,45.72 21.59,45.72 23.11,45.72 37.59,55.12 46.23,55.12 78.23,55.12 79.25,55.12 85.85,55.12 86.87,55.12 57.91,55.12 58.93,55.12 65.53,55.12 66.55,55.12 38.61,55.12 45.21,55.12 18.29,55.12 24.89,55.12 40.39,47.24 41.91,47.24 43.43,47.24 43.43,45.72 41.91,45.72 40.39,45.72 58.17,47.24 58.17,46.48 59.18,48.01 59.18,47.24 65.28,47.24 59.18,46.48 79.5,48.01 85.6,47.24 85.6,48.01 79.5,47.24 79.5,46.48 85.6,46.48 16,42.93 9.65,58.42 9.65,59.69 12.7,58.42 29.97,55.37 29.97,57.91 29.97,56.64 76.83,39.37 82.8,37.47 37.34,43.69 56.39,39.62 68.83,38.35 44.7,36.07 24.38,37.34 46.35,17.14 41.53,30.1 35.81,24.38 12.7,59.69 33.27,57.91 33.27,56.64 33.27,55.37 50.67,55.24 70.74,57.78 9.65,57.15 12.7,57.15 50.67,57.78 50.67,56.52 53.98,57.78 53.98,56.52 53.98,55.24 70.74,56.52 70.74,55.24 74.04,57.78 74.04,56.52 74.04,55.24 82.55,55.88 78.49,47.24 78.49,48.01 86.61,48.01 86.61,47.24 62.23,55.88 41.91,55.88 65.28,46.48 65.28,45.72 66.29,46.48 66.29,47.24 66.29,45.72 86.61,46.48 58.17,48.01 65.28,44.96 66.29,44.96 65.28,48.01 66.29,48.01 58.17,45.72 59.18,45.72 21.59,55.88 60.45,47.24 62.23,47.24 64.01,47.24 64.01,45.72 62.23,45.72 60.45,45.72 80.77,47.24 80.77,45.72 82.55,45.72 84.33,45.72 84.33,47.24 82.55,47.24 78.49,46.48 78.49,45.72 79.5,45.72 85.6,45.72 85.6,44.96 86.61,45.72 86.61,44.96 37.85,47.24 37.85,46.48 38.86,48.01 38.86,47.24 38.86,46.48 37.85,48.01 37.85,45.72 38.86,45.72 44.96,48.01 44.96,47.24 44.96,46.48 44.96,45.72 44.96,44.96 45.97,44.96 45.97,45.72 45.97,46.48 45.97,47.24 45.97,48.01 18.54,48.01 17.53,48.01 17.53,47.24 17.53,46.48 17.53,45.72 18.54,45.72 18.54,46.48 18.54,47.24 24.64,48.01 25.65,48.01 25.65,47.24 25.65,46.48 25.65,45.72 25.65,44.96 24.64,44.96 24.64,45.72 24.64,46.48 24.64,47.24 49.15,15.75 64.01,22.61 88.77,22.99 85.09,22.35 33.66,26.16 79.25,27.43 89.92,46.23 50.55,45.21 41.27,38.48 38.73,30.86 44.07,31.88 34.54,34.54 36.83,30.99 51.44,16.26 22.99,33.53 81.03,22.35 81.03,21.08 85.09,21.34 85.09,23.37 96.01,20.57 98.55,18.29 100.08,18.29 99.31,14.99 100.84,14.99 96.01,24.89 96.01,23.62 97.54,22.86 99.31,22.86 99.31,30.48 99.31,29.46 99.31,28.45 98.81,33.27 100.08,33.27 99.31,38.35 99.31,37.34 99.31,36.32 100.84,43.18 102.11,43.18 103.38,43.18 97.03,45.97 97.03,46.99 97.03,44.96 98.55,49.78 99.82,49.78 95.5,49.28 98.55,53.85 100.33,53.85 99.57,59.44 99.57,58.17 99.57,56.9 106.68,41.91 106.68,43.18 81.28,28.96 79.76,28.96 68.07,19.3 71.88,18.54 68.58,12.19 70.1,12.19 70.1,10.92 49.28,14.99 45.21,18.03 41.91,18.29 42.67,19.05 43.43,19.81 39.88,19.3 40.89,20.32 39.62,20.57 38.86,21.34 38.1,22.1 37.34,22.86 36.58,23.62 33.02,25.15 28.96,22.35 28.96,23.88 24.13,32.51 24.13,30.73 22.86,31.5 14.99,42.93 14.99,41.91 16,6.86 17.02,6.86 34.29,17.78 32.77,16.51 32.77,14.99 30.73,14.99 27.43,21.34 27.43,19.81 43.43,28.19 44.45,27.43 46.99,29.46 45.72,30.73 43.94,30.48 42.16,36.07 42.16,34.54
  pour Top (isolate 0.203, rank 6): 0,60.96 110.24,60.96 110.24,0 0,0
  pour Bottom (rank 6): 0,60.96 110.24,60.96 110.24,0 0,0
  pour GND (isolate 0.254): 0,60.96 110.24,60.96 110.24,0 0,0
  pour GND (isolate 0.254, no thermals): 4.32,48.26 1.02,48.26 1.02,36.58 4.32,36.58
  pour Top (isolate 0.254, no thermals): 3.81,36.83 0.76,36.83 0.76,25.65 3.81,25.65
  pour Bottom (no thermals): 0.76,37.08 3.81,37.08 3.81,25.4 0.76,25.4
HOTBED-GND
  pour Top (isolate 0.254, no thermals): 11.43,17.14 14.99,17.14 15.49,16.64 15.49,15.37 14.99,14.86 11.43,14.86 11.43,11.94 6.1,11.94 6.1,19.81 11.43,19.81
  pour Bottom (isolate 0.254, no thermals): 5.84,19.68 10.41,19.68 10.41,17.14 15.24,17.14 15.75,16.64 15.75,15.11 15.24,14.61 10.41,14.61 10.29,12.19 5.84,12.19
HOTEND-GND
  pour Top (isolate 0.254, no thermals): 5.59,46.99 9.14,46.99 9.4,46.74 9.4,45.72 9.14,45.47 6.35,45.47 4.57,43.69 4.57,41.4 2.54,41.4 2.54,45.97 4.57,45.97
MCU_DN
  Top 0.254: R7.1 28.19,18.8 27.94,18.54 27.94,14.22 25.91,12.19 25.91,9.14 23.88,7.11 18.29,7.11 17.59,7.81 U9.3 13.14,7.81 12.95,7.62 12.95,5.84 12.56,5.45 J3.D-
MCU_DP
  Top 0.254: J3.D+ 13.21,5.33 13.85,5.98 | U9.1 13.85,5.98 | 13.85,5.98 17.66,5.98 18.29,6.6 24.13,6.6 26.42,8.89 26.42,11.94 29.15,14.67 R8.1
MISO  (via drill 0.3)
  Top 0.254: U8.13 70.28,25.99 v69.85,26.42 | v65.53,21.84 64.01,21.84 v63.5,21.34 | v61.21,15.49 60.2,15.49 54.86,10.16 54.86,8.89 53.85,7.87 49.02,7.87 v47.75,9.14 | U6.13 39.88,14.21 v39.88,12.95
  Top 0.305: U8.13 72.47,25.99 JP4.6
  Bottom 0.254: v69.85,26.42 69.6,26.42 69.09,26.92 66.8,26.92 65.53,25.65 v65.53,21.84 | v63.5,21.34 61.72,19.56 61.72,16 v61.21,15.49 | v47.75,9.14 45.21,9.14 41.4,12.95 v39.88,12.95
MODEL-FAN  (via drill 0.3)
  Top 0.254: U6.41 | U6.41 50.29,30.28 v50.29,31.5
  Top 0.406: Q3.1 97.34,54.67 97.28,54.61 R14.1 97.22,54.61 v95.76,54.61
  Bottom 0.254: v95.76,54.61 90.68,49.53 90.68,37.34 89.15,35.81 59.69,35.81 58.42,34.54 58.42,33.78 57.91,33.27 56.39,33.27 54.36,35.31 50.8,35.31 49.78,34.29 49.78,32 v50.29,31.5
MOSI  (via drill 0.3)
  Top 0.254: U6.12 41.3,16.76 43.43,16.76 43.94,16.26 v43.94,15.49 | U8.11 70.15,24.69 69.85,24.38 v69.34,24.38 | v64.26,19.3 v64.26,17.78
  Top 0.305: U8.11 72.34,24.69 73.15,23.88 75.44,23.88 JP4.3
  Bottom 0.254: v43.94,15.49 43.94,14.22 47.24,10.92 60.71,10.92 64.26,14.48 v64.26,17.78 | v69.34,24.38 68.58,23.62 68.58,23.11 64.77,19.3 v64.26,19.3
N$1
  Top 0.406: R1.1 81.28,32.83 LED1.A 81.28,33.02
N$2
  Top 0.61: D2.C 101.35,57.94
  Top 1.27: FAN.2 102.37,53.09 Q3.3 101.73,58 D2.C
N$3
  Top 0.254: U6.4 35.04,19.56 33.53,19.56 32.77,18.8 R7.2 30.99,18.8
N$4
  Top 0.254: U6.5 35.41,18.8 33.78,18.8 32.13,17.14 R8.2
N$5
  Top 1.27: D3.C 101.73,48.68 Q4.3 102.5,50.55 FAN.3
N$6
  Top 1.27: D4.C 102.11,45.09 Q5.3 106.68,46.74 FAN.4
N$7
  Top 0.813: R11.2 21.91,25.72 21.4,25.72 19.3,23.62 19.3,20.83 17.02,18.54 Q2.1
N$8
  Top 1.27: D5.C 101.31,25.15 Q6.3 BLUE-LED.2
N$9
  Top 0.406: U6.7 35.81,16.94 35.81,16.77 | C11.2 35.81,16.77 | 35.81,16.77 35.81,16.76
N$10
  Top 0.406: JP9.3 22.86,51.97 21.89,51 U2.18
N$11
  Top 0.254: U2.1 16.63,42.02 C5.2
N$12
  Top 0.254: U2.2 18.64,41.36 C5.1
N$13
  Top 0.254: U2.8 22.54,40.76 R2.1
N$14
  Top 0.406: U2.17 22.54,50.84 23.94,52.24 R17.1
N$15
  Top 0.406: R18.1 19.24,52.24 20.59,50.89 U2.20
N$16
  Top 0.406: U2.3 19.29,44.46 19.05,44.7 15.89,44.7 C4.2
N$17
  Top 0.406: U2.15 23.84,50.51 24.51,51.18 25.53,51.18 26.92,52.58 26.92,56.13 JP9.4
N$18
  Top 0.406: D-SUB.5 100.03,12.49 97.47,15.05 R45.2
N$19
  Top 0.254: C8.2 19.94,40.63 U2.4
N$20
  Top 0.406: JP9.2 20.32,51.97 21.24,51.05 U2.19
N$21
  Top 0.254: U2.7 21.89,44.37 22.1,44.58 22.86,44.58 23.11,44.32 23.11,43.46 U2.9 23.19,41.77 R4.2
N$22
  Top 0.508: U1.3 89.41,20.83 89.41,20.07 88.9,19.56 87.44,19.56 R38.1
  Top 0.813: R37.2 85.6,19.3 85.85,19.56 87.31,19.56 R38.1
N$23
  Top 0.406: U2.22 19.29,50.43 18.54,51.18 17.65,51.18 16.26,52.58 16.26,56.13 JP9.1
N$24
  Top 0.406: JP1.2 40.64,52.02 41.56,51.1 U3.19
N$25
  Top 0.406: U3.22 39.61,50.43 38.86,51.18 37.85,51.18 36.58,52.45 36.58,56.13 JP1.1
N$26
  Top 0.406: U3.15 44.16,50.51 44.83,51.18 46.1,51.18 47.24,52.32 47.24,56.13 JP1.4
N$27
  Top 0.254: U2.5 20.59,39.39 19.05,37.85 15.24,37.85 14.61,38.48 MS-X.1
N$28
  Top 0.254: U2.6 21.24,39.27 19.3,37.34 14.99,37.34 12.83,39.5 MS-X.3
N$29
  Top 0.254: U3.1 37.08,42.16 37.08,41.29 C17.2
N$30
  Top 0.254: U3.2 38.96,41.36 C17.1
N$31
  Top 0.406: JP1.3 43.18,52.02 42.21,51.05 U3.18
N$32
  Top 0.406: U3.20 40.91,50.91 39.56,52.26 R19.1
N$33
  Top 1.27: D6.C 101.31,33.27 Q7.3 RED-LED.2
N$34
  Top 0.254: U3.8 42.86,40.64 42.79,40.57 R20.1
N$35
  Top 0.254: U3.4 40.26,40.01 39.37,39.12 C19.2
N$36
  Top 0.254: U3.7 42.21,44.37 42.42,44.58 43.31,44.58 43.51,44.37 U3.9 43.51,42.02 44.7,40.83 R22.2
N$37
  Top 0.254: 36.06,44.7 36.07,44.7 C21.2
  Top 0.406: U3.3 39.61,44.46 39.37,44.7 36.06,44.7
N$38
  Top 0.406: U3.17 42.86,50.86 44.26,52.26 R16.1
N$39
  Top 0.406: U4.15 64.48,50.51 65.15,51.18 66.17,51.18 67.56,52.58 67.56,56.13 JP3.4
N$40
  Top 0.406: JP3.3 63.5,52.02 62.53,51.05 U4.18
N$41
  Top 0.406: JP3.2 60.96,52.02 61.88,51.1 U4.19
N$42
  Top 0.254: U3.5 40.91,39.89 39.88,38.86 39.88,38.1 39.62,37.85 35.56,37.85 34.92,38.48 MS-Y.1
N$43
  Top 0.254: U3.6 41.56,39.78 40.39,38.61 40.39,37.85 39.88,37.34 33.78,37.34 33.15,37.97 MS-Y.3
N$44
  Top 0.254: U4.1 57.77,43.38 C22.2
N$45
  Top 0.254: U4.2 59.28,41.4 C22.1
N$46
  Top 0.406: U4.17 63.18,50.86 64.58,52.26 R24.1
N$47
  Top 0.406: U4.20 61.23,50.91 59.88,52.26 R25.1
N$48
  cutout Top: 63.25,23.37 63.25,19.3 56.64,19.3 56.64,23.37
N$49
  Top 0.254: U4.8 63.18,40.57 R26.1
N$50
  Top 0.254: U4.4 60.58,39.5 60.45,39.37 C24.2
N$51
  Top 0.254: U4.7 62.53,44.37 62.74,44.58 63.63,44.58 63.83,44.37 U4.9 63.83,41.77 R28.2
N$52
  Top 0.457: U4.3 59.93,44.46 59.69,44.7 57.01,44.7
  Top 0.508: 57.01,44.7 56.5,44.7 C26.2
N$53
  Top 0.406: U4.22 59.93,50.43 59.18,51.18 58.17,51.18 56.9,52.45 56.9,56.13 JP3.1
N$54
  Top 0.406: U5.15 84.8,50.43 85.72,51.36 86.67,51.36 87.88,52.58 87.88,56.13 JP5.4
N$55
  Top 0.406: U5.18 82.85,51.02 83.82,51.99 JP5.3
N$56
  Top 0.406: U5.19 82.2,51.02 81.28,51.94 JP5.2
N$57
  Top 0.254: U4.5 61.23,38.88 60.45,38.1 55.37,38.1 54.99,38.48 MS-Z.1
N$58
  Top 0.254: U4.6 61.88,38.51 60.83,37.47 54.1,37.47 53.21,38.35 MS-Z.3
N$59
  Top 0.254: U5.1 78.09,42.53 C27.2
N$60
  Top 0.254: U5.2 79.6,41.4 C27.1
N$61
  Top 0.406: U5.17 83.5,50.86 84.9,52.26 R30.1
N$62
  Top 0.406: U5.20 81.55,50.86 80.26,52.15 80.26,53.53
  Top 0.457: 80.26,53.53 R31.1
N$63
  Top 0.406: D-SUB.4 95.5,14.1 R44.2
N$64
  Top 0.254: U5.8 83.5,40.64 R32.1
N$65
  Top 0.254: U5.4 80.9,39.5 80.77,39.37 C29.2
N$66
  Top 0.254: U5.7 82.85,44.37 83.06,44.58 83.95,44.58 84.15,44.37 U5.9 84.15,42.02 R34.2
N$67
  Top 0.356: U5.3 80.25,44.46 80.01,44.7 77.59,44.7 C31.2
N$68
  Top 0.356: U5.22 80.26,49.5
  Top 0.406: 80.26,49.5 80.26,50.42 79.38,51.31 78.49,51.31 77.22,52.58 77.22,56.13 JP5.1
N$69
  Top 0.406: D-SUB.3 93.47,13.36 R43.2
N$70
  Top 0.406: D-SUB.2 91.69,12.37 R42.2
N$71
  Top 0.406: R36.2 10.35,50.23 8.89,48.77 Q1.1 7.87,48.77
N$72
  Top 0.254: U5.5 81.55,38.62 80.77,37.85 76.2,37.85 75.31,38.73 MS-E.1
N$73
  Top 0.254: U5.6 82.2,38.26 81.28,37.34 74.42,37.34 73.53,38.23 MS-E.3
N$74
  Top 0.406: R41.2 89.92,13.31 D-SUB.1
N$75
  Top 0.254: U1.6 91.81,23.35 91.57,23.11 91.57,21.21 92.34,20.44 C2.1
  Top 0.61: 90.68,26.42 L1.P$1 | 90.68,26.42 92.71,24.38 92.71,23.42 U1.6 | D1.C 87.09,22.83 90.68,26.42
N$77
  Top 0.254: U1.1 90.82,23.35 91.06,23.11 91.06,20.95 90.54,20.44 C2.2
PB6  (via drill 0.3)
  Top 0.254: U6.16 42.8,13.59 v45.47,10.92
  Bottom 0.254: v45.47,10.92 46.48,10.92 46.99,10.41 60.96,10.41 65.02,14.48 65.02,18.03 69.34,22.35 69.85,22.35 71.63,24.13 71.63,32.26 JP11.3
PC0
  Top 0.254: JP11.12 60.96,29.21 57.4,29.21 55.63,27.43 54.23,27.43 U6.35
PC1
  Top 0.254: JP11.13 61.47,32.26 61.47,30.48 60.71,29.72 57.15,29.72 55.37,27.94 53.6,27.94 U6.36
PC2
  Top 0.254: U6.37 52.98,28.45 55.12,28.45 56.9,30.23 59.44,30.23 JP11.14
PD4
  Top 0.254: U6.29 52.84,19.81 54.61,19.81 56.64,21.84 56.64,23.88 58.93,26.16 63.5,26.16 65.53,28.19 68.58,28.19 69.85,29.46 70.61,29.46 71.63,30.48 71.63,31.5 70.87,32.26 69.09,32.26 JP11.7
PD5
  Top 0.254: U6.30 53.21,20.57 54.61,20.57 56.13,22.1 56.13,24.13 58.67,26.67 63.25,26.67 65.28,28.7 68.07,28.7 JP11.6
PD6
  Top 0.254: U6.31 53.84,21.08 54.36,21.08 55.63,22.35 55.63,24.38 58.42,27.18 62.99,27.18 65.02,29.21 67.82,29.21 69.09,30.48 69.09,31.5 68.33,32.26 66.55,32.26 JP11.9
PD7
  Top 0.254: JP11.8 66.55,29.72 64.77,29.72 62.74,27.69 58.17,27.69 55.12,24.64 55.12,23.51 U6.32
PE0
  Top 0.254: JP11.10 62.42,28.19 57.91,28.19 56.13,26.42 55.41,26.42 U6.33
PE1
  Top 0.254: 54.85,26.92 55.88,26.92 57.66,28.7 62.23,28.7 64.01,30.48 64.01,32.26 JP11.11 | U6.34 54.85,26.92 | 54.85,26.92
RED-LED  (via drill 0.3)
  Top 0.254: U6.28 52.22,19.3 54.36,19.3 55.37,18.29 v56.39,18.29 | v77.98,12.7 77.98,10.92 75.95,8.89 69.09,8.89 63.5,14.48 v61.21,14.48
  Top 0.305: R40.1 v96.01,34.22 v96.01,34.29
  Top 0.406: Q7.1 R40.1
  Bottom 0.254: v96.01,34.22 96.01,27.43 95,26.42 95,25.91 89.92,20.83 88.9,20.83 82.8,14.73 80.01,14.73 v77.98,12.7 | v56.39,18.29 58.42,16.26 59.44,16.26 v61.21,14.48
RF3  (via drill 0.3)
  Top 0.254: U6.58 43.01,22.86 v50.29,22.86
  Bottom 0.254: v50.29,22.86 48.51,24.64 48.51,26.42 50.04,27.94 50.04,29.97 51.05,30.99 51.05,31.75 50.29,32.51 50.29,33.78 51.31,34.8 54.1,34.8 56.13,32.77 58.42,32.77 58.93,33.27 58.93,34.29 59.94,35.31 68.58,35.31 JP11.5
SCL  (via drill 0.3)
  Top 0.254: U6.25 49.33,18.8 45.72,18.8 45.21,19.3 v45.21,20.07 | U10.2 31.63,32.88 | 31.63,32.88 32.26,32.26 32.26,30.48 v32.51,30.23 | 31.63,32.88 31.63,32.9 33.02,34.29 33.02,34.86 R5.1
  Bottom 0.254: v32.51,30.23 35.56,27.18 38.1,27.18 v45.21,20.07 38.35,13.21 31.11,13.21 JP7.1
SCLK  (via drill 0.3)
  Top 0.254: U6.11 40.67,17.27 44.2,17.27 v44.7,16.76 | U8.12 69.4,25.34 v69.09,25.65
  Top 0.305: U8.12 72.71,25.34 72.9,25.15 JP4.4
  Bottom 0.254: v44.7,16.76 44.7,14.22 47.5,11.43 60.45,11.43 62.74,13.72 62.74,19.05 63.75,20.07 64.77,20.07 68.07,23.37 68.07,24.64 v69.09,25.65
SDA  (via drill 0.3)
  Top 0.254: U6.26 49.7,19.56 v45.97,19.56 | U10.3 31.37,32.38 31.75,32 31.75,29.72 | 31.75,29.72 32,29.46 v34.29,29.46 | R15.1 31.24,30.23 31.75,29.72
  Bottom 0.254: v34.29,29.46 35.81,27.94 38.1,27.94 45.21,20.83 45.72,20.83 45.97,20.57 v45.97,19.56 45.47,19.05 44.96,19.05 38.61,12.7 33.15,12.7 JP7.2
SDCD  (via drill 0.3)
  Top 0.254: U6.17 44.7,14.38 44.7,15.24 v45.47,16
  Bottom 0.254: v45.47,16 45.47,14.22 47.75,11.94 60.2,11.94 62.23,13.97 62.23,19.3 63.5,20.57 64.01,20.57 64.77,21.34 64.77,25.65 66.55,27.43 69.6,27.43 70.61,28.45
  Bottom 0.406: J1.SB 70.61,28.9 70.61,28.45
SDCLK  (via drill 0.3)
  Top 0.254: U8.3 64.2,25.34 63.75,24.89 v61.98,24.89
  Bottom 0.406: J1.5 61.32,25.55 v61.98,24.89
SDCS  (via drill 0.3)
  Top 0.254: U8.10 70.27,24.04 v69.6,23.37 | v55.37,19.3 62.74,19.3 v63.5,18.54 | U6.10 43.1,20.83 45.72,20.83 46.48,20.07 49.28,20.07 v50.04,20.83
  Bottom 0.254: v63.5,18.54 64.77,18.54 v69.6,23.37 | v50.04,20.83 53.85,20.83 v55.37,19.3
SDCSH  (via drill 0.3)
  Top 0.254: U8.5 64.42,24.04 64.01,23.62 59.18,23.62 58.93,23.37 v57.66,23.37
  Bottom 0.406: J1.1 51.32,28.44 52.58,27.18 53.85,27.18 v57.66,23.37
SDDI  (via drill 0.3)
  Top 0.254: U8.4 64.31,24.69 63.75,24.13 v58.42,24.13
  Bottom 0.406: J1.2 53.82,28.73 v58.42,24.13
VBUS
  Top 0.254: U6.8 38.86,18.85 38.86,19.3 36.45,21.72 36.07,21.72 U6.3 34.42,20.07 29.21,20.07 28.57,20.7 27.56,20.7 | 27.56,20.7 | J3.VBUS 11.91,4.6 11.43,5.08 10.92,5.08 10.67,5.33 10.67,6.86 | 10.67,6.86 U9.5 12.19,6.86 12.45,7.11 12.45,7.87 13.21,8.64 17.53,8.64 18.29,7.87 23.88,7.87 25.34,9.34 25.34,12.39 27.43,14.48 C14.1 27.43,20.7 27.56,20.7 | 10.67,6.86 8.64,6.86 JP2.1
VREF_E  (via drill 0.3)
  Top 0.254: C41.1 89.92,43.18 | U10.6 35.67,31.39 v35.81,31.24 | v88.9,36.83 90.42,38.35 90.42,41.15 89.92,41.66 C41.1 | U5.12 87.17,43.38 87.51,43.04 C41.1
  Bottom 0.254: v88.9,36.83 88.39,36.32 74.68,36.32 73.41,37.59 71.88,37.59 71.12,36.83 41.4,36.83 v35.81,31.24
VREF_X  (via drill 0.3)
  Top 0.254: U2.12 26.72,43.38 27.18,42.93 C39.1 28.31,41.54 29.21,40.64 v29.97,40.64 | U10.9 34.92,32.88 35.31,33.27 v35.31,35.31
  Bottom 0.254: v29.97,40.64 29.97,39.62 31.24,38.35 32.77,38.35 35.31,35.81 v35.31,35.31
VREF_Y  (via drill 0.3)
  Top 0.254: U3.12 47.3,43.38 48.01,42.67 C38.1 48.88,41.54 49.28,41.15 49.78,41.15 50.55,40.39 v50.55,38.86 | U10.8 35.18,32.38 36.07,33.27 v36.07,33.53
  Bottom 0.254: v50.55,38.86 50.55,38.61 49.78,37.85 39.37,37.85 36.07,34.54 v36.07,33.53
VREF_Z  (via drill 0.3)
  Top 0.254: v70.87,37.85 70.87,39.88 70.61,40.13 C40.1 68.46,42.03 67.11,43.38 U4.12 | U10.7 35.7,31.89 37.08,33.27 v37.08,33.53
  Bottom 0.254: v70.87,37.85 70.36,37.34 39.62,37.34 36.83,34.54 36.83,33.78 v37.08,33.53
X-DIR
  Top 0.254: U2.14 24.49,50.4 24.77,50.67 28.83,50.67 29.21,50.29 29.21,49.53 29.46,49.28 30.48,49.28 31.24,48.51 31.24,37.34 31.75,36.83 38.09,36.83 U6.50
X-STEP
  Top 0.254: U2.11 24.49,42.31 24.64,42.16 26.92,42.16 30.73,38.35 30.73,36.83 31.24,36.32 37.47,36.32 U6.51
X-STOP
  Top 0.254: JP12.1 24.38,6.1 26.92,8.64 26.92,11.68 28.19,12.95 34.09,12.95 U6.9
XTAL1
  Top 0.254: X1.P$1 55.77,15.48 C44.2 54.1,17.02 49.98,17.02 U6.24
XTAL2
  Top 0.254: U6.23 50.55,15.32 50.55,13.21 | 50.55,13.21 50.8,13.21 51.31,12.7 52.32,12.7 52.83,12.19 52.83,11.94 X1.P$2 | C43.2 50.55,13.21
Y-DIR
  Top 0.254: U3.14 44.81,50.4 45.09,50.67 49.4,50.67 49.78,50.29 49.78,49.53 50.04,49.28 51.31,49.28 51.82,48.77 51.82,39.12 50.55,37.85 49.53,37.85 48.26,36.58 46.99,36.58 45.97,35.56 45.97,33.88 U6.48
Y-STEP
  Top 0.254: U3.11 44.81,42.31 44.96,42.16 47.24,42.16 48.77,40.64 49.53,40.64 49.78,40.39 49.78,38.86 48.01,37.08 46.74,37.08 42.91,33.25 | 42.91,33.25 | 42.91,33.25 U6.49
Y-STOP
  Top 0.254: JP8.1 35.56,7.37 40.39,7.37 40.89,7.87 40.89,14.1 U6.14
Z-DIR
  Top 0.254: U4.14 65.13,50.4 65.41,50.67 69.6,50.67 69.85,50.42 69.85,49.53 70.1,49.28 71.37,49.28 71.88,48.77 71.88,36.96 71.12,36.2 50.55,36.2 U6.46
Z-STEP
  Top 0.254: U4.11 65.13,42.31 65.28,42.16 67.56,42.16 70.1,39.62 70.1,37.21 69.72,36.83 50.05,36.83 U6.47
Z-STOP
  Top 0.254: U6.18 46.74,13.47 46.74,9.91 45.97,9.14 42.67,9.14 41.66,8.13 JP10.1

## Text on the board
tNames: Reset
_tsilk: C6 | D2 | C16 | C18 | C23 | FAN | R24 | X-MOT | Y-MOT | Z-MOT | E-MOT | R14 | Q3 | R18 | R17 | R19 | R25 | R31 | R30 | HOTEND | Q1 | C28 | C33 | R16 | C35 | C37 | Q4 | U2 | U3 | U4 | U5 | R36 | C21 | C26 | C31 | R23 | C4 | Q5 | R3 | C39 | C38 | D3 | D4 | C17 | C41 | C5 | R21 | R27 | C22 | C40 | R33 | C27 | R29 | PWR | R6 | MS-X | MS-Y | MS-Z | MS-E | C8 | R2 | R4 | C15 | C19 | R20 | R22 | C20 | C24 | R26 | R28 | C25 | C29 | R32 | R34 | C30 | RED-LED | C45 | IC1 | R5 | R13 | R40 | Q7 | C42 | 5V | C13 | U10 | D1 | BOOT | R15 | R11 | C3 | EXP2 | U8 | R1 | L1 | R39 | Q6 | U6 | C34 | C1 | R35 | U1 | BLUE-LED | C12 | HOTBED | C32 | R38 | C14 | C44 | R9 | ICSP | R37 | C2 | R7 | R8 | C11 | C43 | C10 | U7 | R41 | Reset | T-EXT | X1 | R12 | R42 | R43 | R44 | R45 | I2C | R10 | C9 | D-SUB | Q2 | T-BED | Y-STOP | Z-STOP | C36 | X-STOP | USB | PWR | U9 | USB
122bmp: /home/ceriand/Downloads/pbrd-logo.bmp